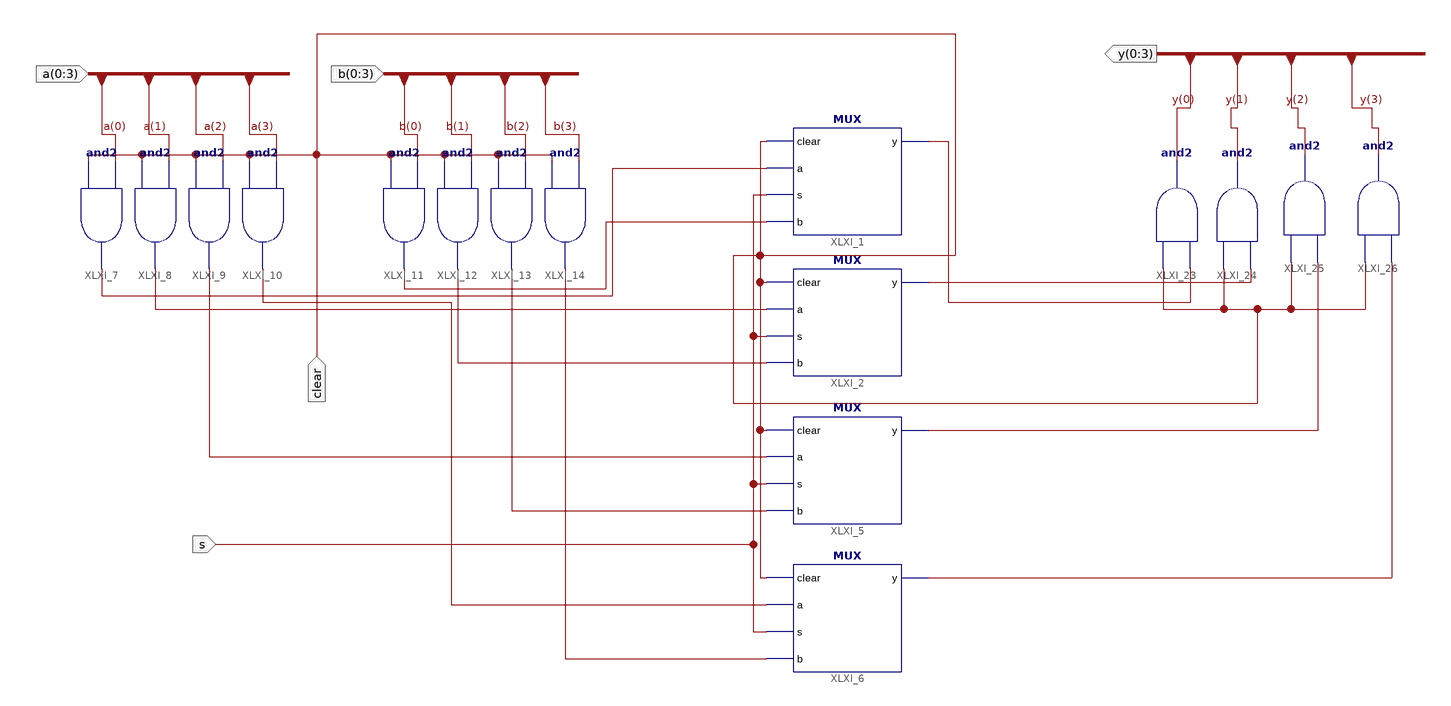
[diagram p0: schematic sheet 1]
// Xilinx ISE schematic fourbitMUX2_1.sch (artix7) as structural Verilog: 16 symbols, 5 ports
module fourbitMUX2_1 (
  input  [0:3] a,
  input  [0:3] b,
  input  clear,
  input  s,
  output [0:3] y
);

  wire XLXN_35, XLXN_36, XLXN_37, XLXN_38, XLXN_39, XLXN_40, XLXN_41, XLXN_48, XLXN_87, XLXN_88, XLXN_89,
       XLXN_90;

  MUX XLXI_1 (.clear(clear), .a(XLXN_35), .s(s), .b(XLXN_39), .y(XLXN_87));
  MUX XLXI_2 (.clear(clear), .a(XLXN_36), .s(s), .b(XLXN_40), .y(XLXN_88));
  MUX XLXI_5 (.clear(clear), .a(XLXN_37), .s(s), .b(XLXN_41), .y(XLXN_89));
  MUX XLXI_6 (.clear(clear), .a(XLXN_38), .s(s), .b(XLXN_48), .y(XLXN_90));
  and XLXI_7 (XLXN_35, clear, a[0]);
  and XLXI_8 (XLXN_36, clear, a[1]);
  and XLXI_9 (XLXN_37, clear, a[2]);
  and XLXI_10 (XLXN_38, clear, a[3]);
  and XLXI_11 (XLXN_39, clear, b[0]);
  and XLXI_12 (XLXN_40, clear, b[1]);
  and XLXI_13 (XLXN_41, clear, b[2]);
  and XLXI_14 (XLXN_48, clear, b[3]);
  and XLXI_23 (y[0], XLXN_87, clear);
  and XLXI_24 (y[1], XLXN_88, clear);
  and XLXI_25 (y[2], XLXN_89, clear);
  and XLXI_26 (y[3], XLXN_90, clear);
endmodule
